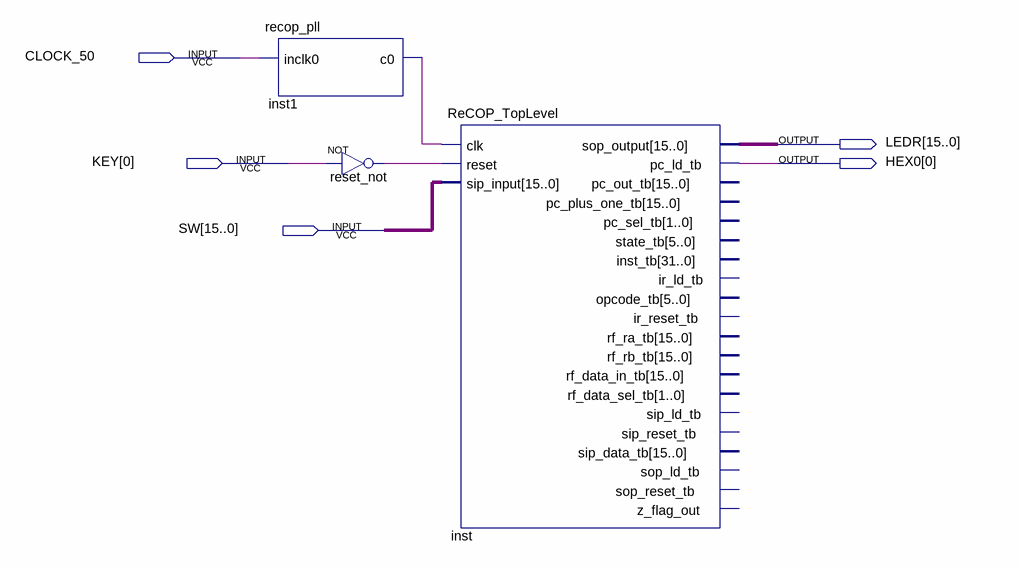
[diagram p0: schematic sheet]
// Quartus schematic ReCOP_bd.bdf as structural Verilog: 3 symbols, 5 pins
module ReCOP_bd (
  input  CLOCK_50,
  input  [0:0] KEY,
  input  [15:0] SW,
  output [15:0] LEDR,
  output [0:0] HEX0
);

  wire inst1_c0, reset_not_out;

  recop_pll inst1 (.inclk0(CLOCK_50), .c0(inst1_c0));
  not reset_not (reset_not_out, KEY[0]);
  ReCOP_TopLevel inst (
    .clk(inst1_c0), .reset(reset_not_out), .sip_input(SW), .sop_output(LEDR), .pc_ld_tb(HEX0[0]));  // open: pc_out_tb, pc_plus_one_tb, pc_sel_tb, state_tb, inst_tb, ir_ld_tb, opcode_tb, ir_reset_tb, rf_ra_tb, rf_rb_tb, rf_data_in_tb, rf_data_sel_tb, sip_ld_tb, sip_reset_tb, sip_data_tb, sop_ld_tb, sop_reset_tb, z_flag_out
endmodule
